# Altium schematic sheet Main.SchDoc
size A
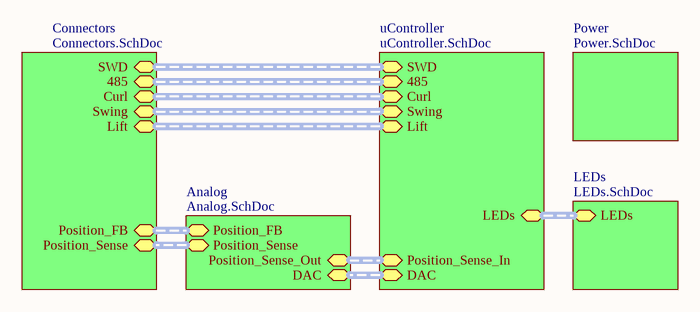
[diagram p0: Main.SchDoc]

## Sub-sheets
Analog = Analog.SchDoc: Position_FB (harness FB_Harness), Position_Sense (harness FB_Harness), Position_Sense_Out (harness FB_Harness), DAC
Connectors = Connectors.SchDoc: SWD (harness SWD_Harness), Position_FB (harness FB_Harness), Curl (harness Actuator_Harness), Swing (harness Actuator_Harness), Lift (harness Actuator_Harness), 485 (harness 485_Harness), Position_Sense (harness FB_Harness)
LEDs = LEDs.SchDoc: LEDs (harness LED_Harness)
Power = Power.SchDoc: no entries
uController = uController.SchDoc: SWD (harness SWD_Harness), Curl (harness Actuator_Harness), Swing (harness Actuator_Harness), Lift (harness Actuator_Harness), 485 (harness 485_Harness), LEDs (harness LED_Harness), Position_Sense_In, DAC (harness DAC_Harness)

## Buses and harness runs
harness sheet Analog/DAC = sheet uController/DAC
harness sheet Analog/Position_FB = sheet Connectors/Position_FB
harness sheet Analog/Position_Sense = sheet Connectors/Position_Sense
harness sheet Analog/Position_Sense_Out = sheet uController/Position_Sense_In
harness sheet Connectors/485 = sheet uController/485
harness sheet Connectors/Curl = sheet uController/Curl
harness sheet Connectors/Lift = sheet uController/Lift
harness sheet Connectors/SWD = sheet uController/SWD
harness sheet Connectors/Swing = sheet uController/Swing
harness sheet LEDs/LEDs = sheet uController/LEDs